# Altium schematic sheet InterceptorRS232.SchDoc
size 594 x 420 mm; Scale: 1:1; Разраб.: Яковлев; Наименование изделия 1: Перехватчик RS-232; Наименование изделия 2: Схема электрическая; Наименование изделия 3: принципиальная; Нач. отд.: Нач. отд.
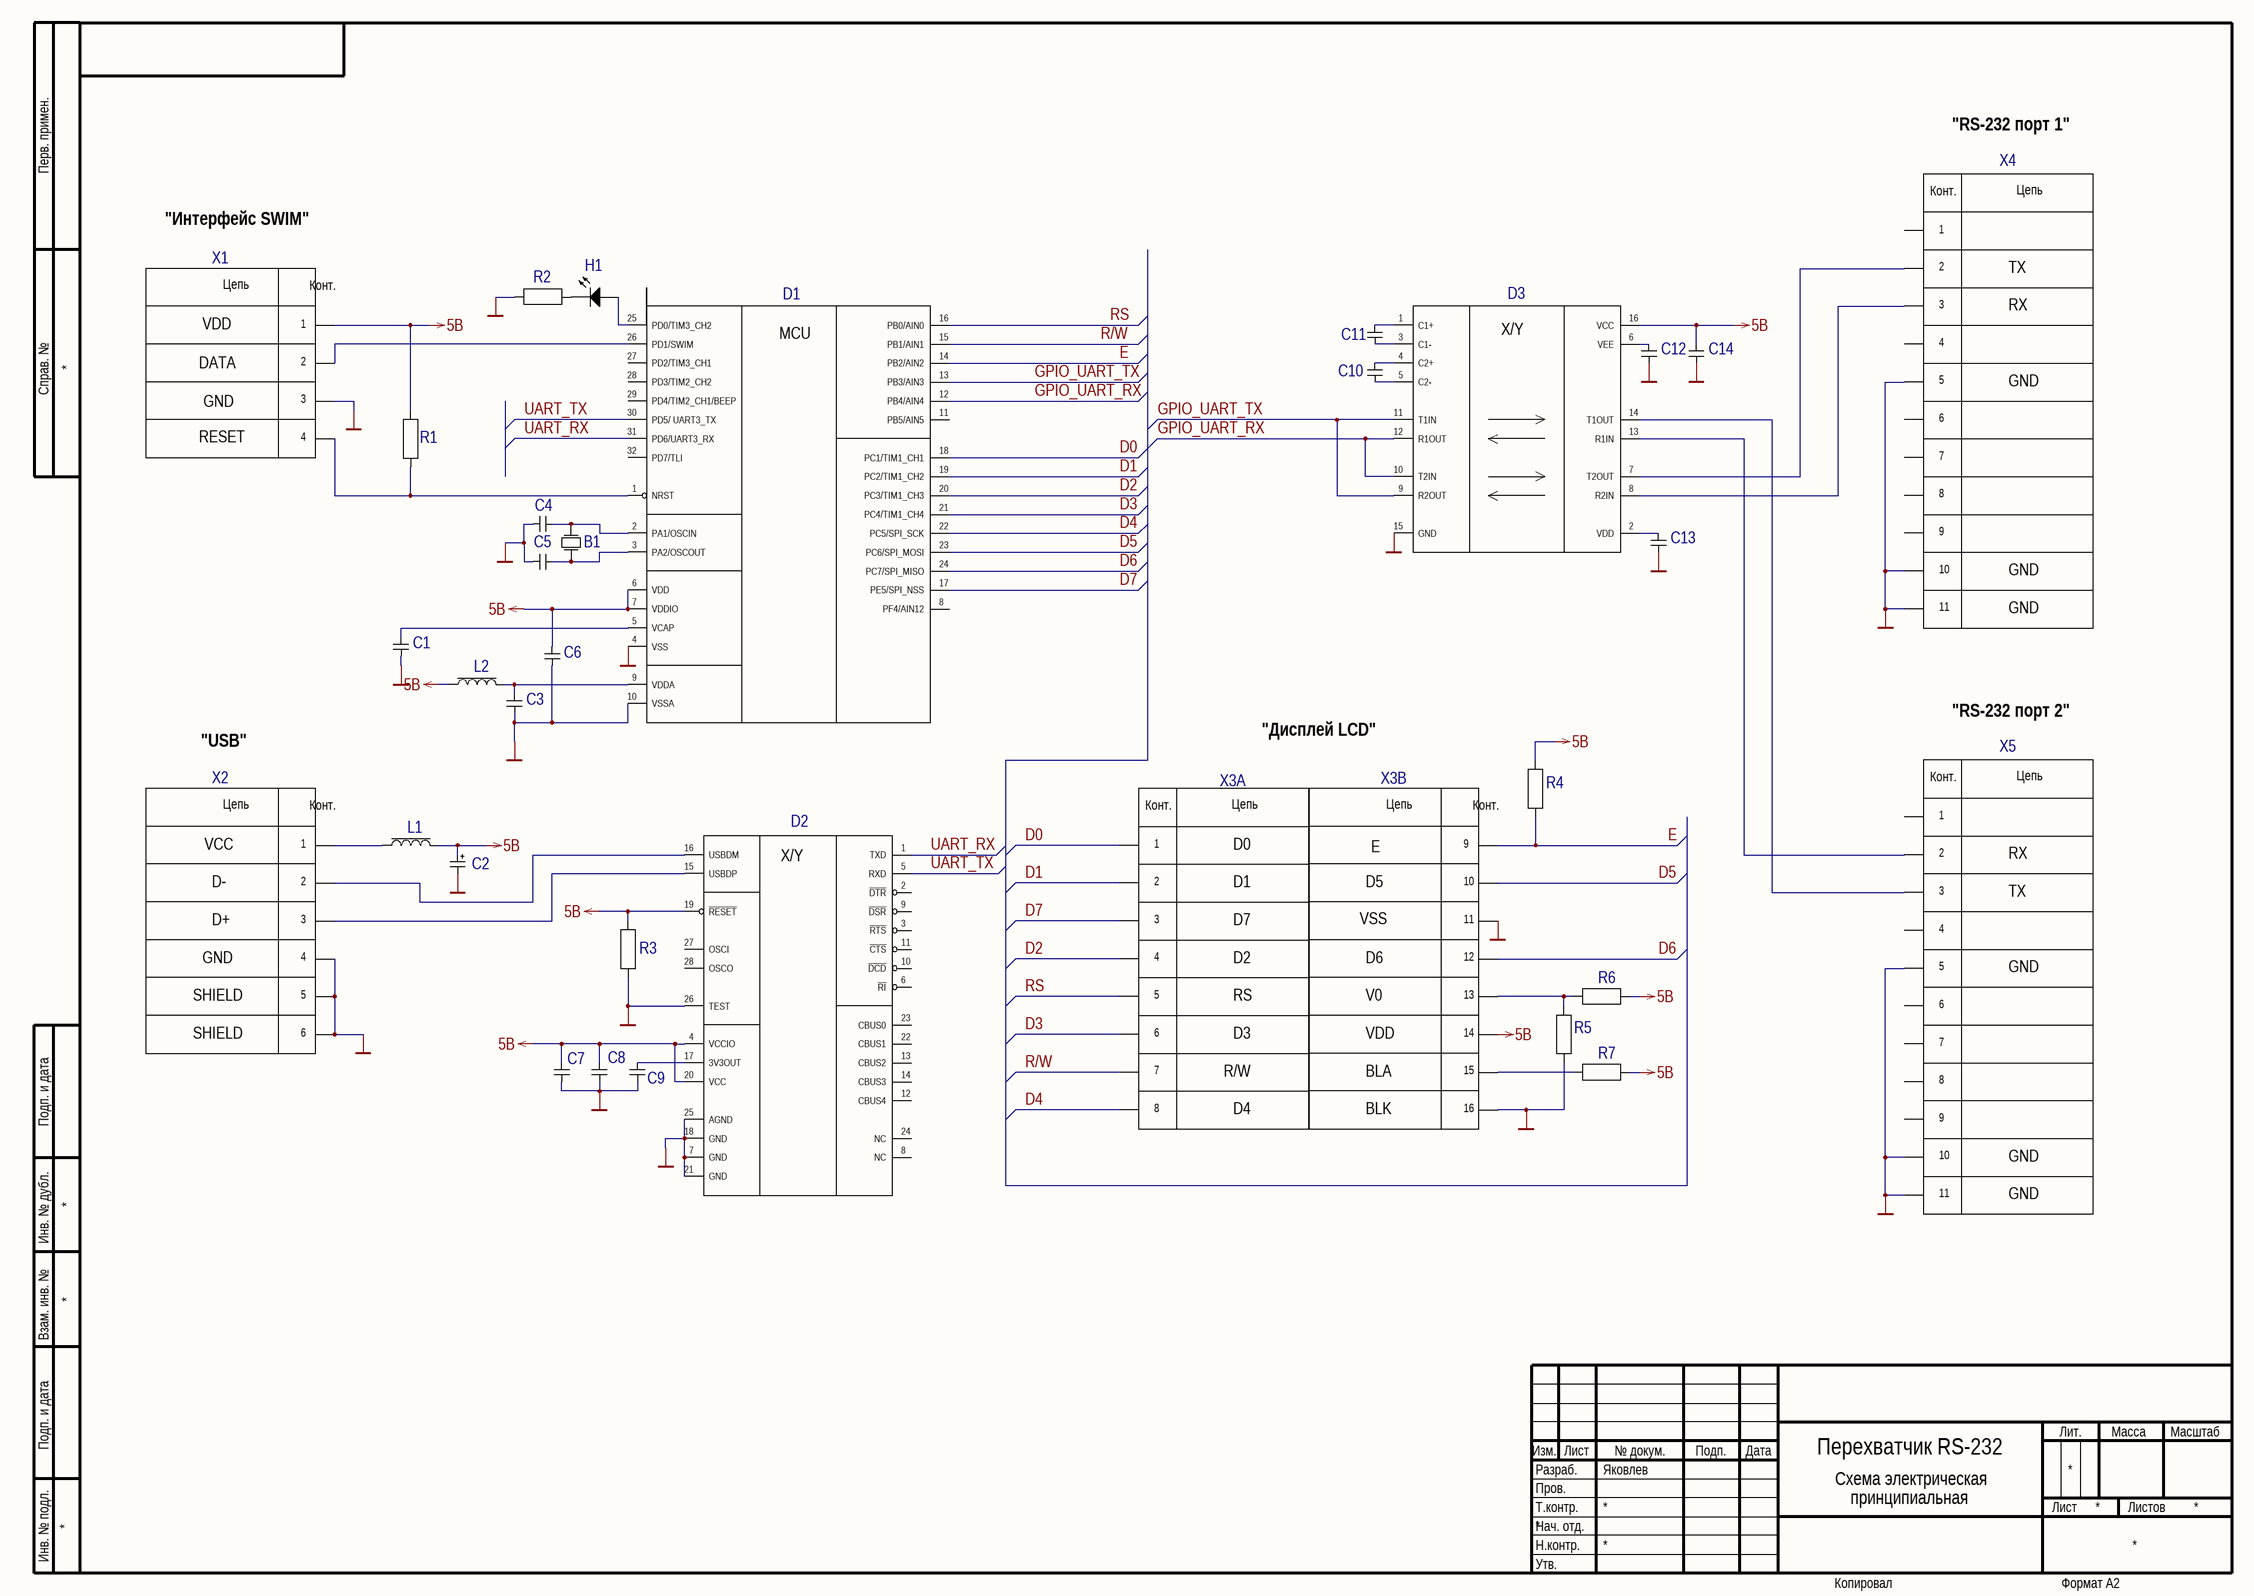
[diagram p0: InterceptorRS232.SchDoc]

## Parts
B1  *  [CSM-7]  (value not drawn)
C1  (no value)  [SMD-0805C]
C2  Cap_el  [CAP_5x11]  (value not drawn)
C3  (no value)  [SMD-0805C]
C4  (no value)  [SMD-0805C]
C5  (no value)  [SMD-0805C]
C6  (no value)  [SMD-0805C]
C7  (no value)  [SMD-0805C]
C8  (no value)  [SMD-0805C]
C9  (no value)  [SMD-0805C]
C10  (no value)  [SMD-0805C]
C11  (no value)  [SMD-0805C]
C12  (no value)  [SMD-0805C]
C13  (no value)  [SMD-0805C]
C14  (no value)  [SMD-0805C]
D1  STM8S207K6T6C  [TQFP32_M]  (value not drawn)
D2  FT232RL-Reel  [SSOP-28_M]  (value not drawn)
D3  MAX232EWE  [SOP-16 (2.54 mm)]  (value not drawn)
H1  (no value)  [LED_3mm]
L1  Inductor  [SMD-0805C]  (value not drawn)
L2  Inductor  [SMD-0805C]  (value not drawn)
R1  (no value)  [SMD-0805-RES]
R2  (no value)  [SMD-0805-RES]
R3  (no value)  [SMD-0805-RES]
R4  (no value)  [SMD-0805-RES]
R5  (no value)  [SMD-0805-RES]
R6  (no value)  [SMD-0805-RES]
R7  (no value)  [SMD-0805-RES]
X1  *  [PLS-4]  (value not drawn)
X2  *  [FCI USB 61729-0010BLF]  (value not drawn)
X3  *  [PLD2x8]  (value not drawn)  (parts A,B of 2)
X4  *  [DB-9F]  (value not drawn)
X5  *  [DB-9M]  (value not drawn)

## Nets
5В: C2.1 C6.2 C7.2 C8.2 C14.2 D1.6(VDD) D1.7(VDDIO) D2.4(VCCIO) D2.19(~{RESET}) D2.20(VCC) D3.16(VCC) L1.2 L2.1 R1.2 R3.2 R4.1 R6.1 R7.1 X1.1 X3.14
GND: C1.1 C2.2 C3.1 C4.2 C5.2 C6.1 C7.1 C8.1 C9.1 C12.1 C13.1 C14.1 D1.4(VSS) D1.10(VSSA) D2.7(GND) D2.18(GND) D2.21(GND) D2.25(AGND) D2.26(TEST) D3.15(GND) R2.2 R3.1 R5.2 X1.3 X2.4 X2.5 X2.6 X3.11 X3.16 X4.5 X4.10 X4.11 X5.5 X5.10 X5.11
D0: D1.18(PC1/TIM1_CH1) X3.1
D1: D1.19(PC2/TIM1_CH2) X3.2
D2: D1.20(PC3/TIM1_CH3) X3.4
D3: D1.21(PC4/TIM1_CH4) X3.6
D4: D1.22(PC5/SPI_SCK) X3.8
D5: D1.23(PC6/SPI_MOSI) X3.10
D6: D1.24(PC7/SPI_MISO) X3.12
D7: D1.17(PE5/SPI_NSS) X3.3
E: D1.14(PB2/AIN2) R4.2 X3.9
GPIO_UART_RX: D1.12(PB4/AIN4) D3.10(T2IN) D3.12(R1OUT)
GPIO_UART_TX: D1.13(PB3/AIN3) D3.9(R2OUT) D3.11(T1IN)
R/W: D1.15(PB1/AIN1) X3.7
RS: D1.16(PB0/AIN0) X3.5
UART_RX: D1.31(PD6/UART3_RX) D2.1(TXD)
UART_TX: D1.30(PD5/_UART3_TX) D2.5(RXD)
NetB1_1: B1.1(OSCIN) C5.1 D1.3(PA2/OSCOUT)
NetB1_2: B1.2(OSCOUT) C4.1 D1.2(PA1/OSCIN)
NetC1_2: C1.2 D1.5(VCAP)
NetC3_2: C3.2 D1.9(VDDA) L2.2
NetC9_2: C9.2 D2.17(3V3OUT)
NetC10_1: C10.1 D3.5(C2-)
NetC10_2: C10.2 D3.4(C2+)
NetC11_1: C11.1 D3.3(C1-)
NetC11_2: C11.2 D3.1(C1+)
NetC12_2: C12.2 D3.6(VEE)
NetC13_2: C13.2 D3.2(VDD)
NetD1_1: D1.1(NRST) R1.1 X1.4
NetD1_25: D1.25(PD0/TIM3_CH2) H1.1(A)
NetD1_26: D1.26(PD1/SWIM) X1.2
NetD2_15: D2.15(USBDP) X2.3
NetD2_16: D2.16(USBDM) X2.2
NetD3_7: D3.7(T2OUT) X4.2
NetD3_8: D3.8(R2IN) X4.3
NetD3_13: D3.13(R1IN) X5.2
NetD3_14: D3.14(T1OUT) X5.3
NetH1_2: H1.2(K) R2.1
NetL1_1: L1.1 X2.1
NetR5_1: R5.1 R6.2 X3.13
NetR7_2: R7.2 X3.15

Not connected (* = marked no-connect by the designer): D1 8(PF4/AIN12) 11(PB5/AIN5) 27(PD2/TIM3_CH1) 28(PD3/TIM2_CH2) 29(PD4/TIM2_CH1/BEEP) 32(PD7/TLI); D2 2(~{DTR}) 3(~{RTS}) 6(~{RI}) 8(NC) 9(~{DSR}) 10(~{DCD}) 11(~{CTS}) 12(CBUS4) 13(CBUS2) 14(CBUS3) 22(CBUS1) 23(CBUS0) 24(NC) 27(OSCI) 28(OSCO); X4 1 4 6 7 8 9; X5 1 4 6 7 8 9

## Notes on the sheet
- "RS-232 порт 1"
- "Интерфейс SWIM"
- RX
- TX
- VDD
- DATA
- GND
- RESET
- "Дисплей LCD"
- "RS-232 порт 2"
- "USB"
- VCC
- D-
- D1
- D0
- D5
- E
- D+
- D7
- VSS
- D2
- D6
- SHIELD
- RS
- V0
- R/W
- D3
- BLA
- D4
- BLK
- Перв. примен.
- Справ. №
- Подп. и дата
- Инв. № дубл.
- Взам. инв. №
- Разраб.
- Изм.
- Лист
- № докум.
- Подп.
- Дата
- Лит.
- Масса
- Масштаб
- Пров.
- Т.контр.
- Листов
- Инв. № подл.
- Утв.
- Н.контр.
- Копировал
- Формат А2
- (in symbol DB-9) Конт.; Цепь
- (in symbol FT232RL-Reel) X/Y
- (in symbol MAX232EWE) X/Y
- (in symbol PLD2x8, part A) Конт.; Цепь
- (in symbol PLD2x8, part B) Цепь; Конт.
- (in symbol PLS-4) Цепь; Конт.
- (in symbol STM8S207/STM8S208) MCU
- (in symbol USB-B) Цепь; Конт.

## Library data of the parts
B1 = CRYSTAL_OSCILLATOR: Crystal oscillator
C1 C3-C14 = Cap: Capacitor; Published: 8-Jun-2000; LatestRevisionDate: 17-Jul-2002; LatestRevisionNote: Re-released for DXP Platform.; PackageReference: RAD-0.3; Publisher: Altium Limited; PackageDescription: Radial Cap, Thru-Hole; 2 Leads; 0.3 in Pin Spacing
C2 = Cap_el: Electrolytic capacitor; Published: 8-Jun-2000; LatestRevisionDate: 17-Jul-2002; LatestRevisionNote: Re-released for DXP Platform.; PackageReference: RAD-0.3; Publisher: Altium Limited; PackageDescription: Radial Cap, Thru-Hole; 2 Leads; 0.3 in Pin Spacing
D1 = STM8S207/STM8S208: 8-bit STM8 MCU
D2 = FT232RL-Reel: USB UART Asynchronous Serial Data Transfer Chip, SSOP-28, Tape and Reel; Published: 19-Aug-2010; DatasheetVersion: ver 2.07, Jul-2010; PackageVersion: 2010; PackageReference: SSOP-28; Publisher: Altium Limited; PackageDescription: 28-Pin Small Outline Package 0.65 mm Pitch; ComponentLink1Description: Manufacturer Link; ComponentLink1URL: http://www.ftdichip.com/Products/ICs/FT232R.htm; ComponentLink2Description: Datasheet; ComponentLink2URL: http://www.ftdichip.com/Support/Documents/DataSheets/ICs/DS_FT232R.pdf
D3 = MAX232EWE: +5V Powered RS-232 Driver/Receiver; Published: 16-Jan-2001; LatestRevisionDate: 13-Apr-2006; LatestRevisionNote: IPC-7351 Footprint Added.; DatasheetVersion: Apr-1992; PackageReference: WSO16; Publisher: Altium Limited; PackageDescription: 16-Pin Small Outline Integrated Circuit 1.27 mm Pitch; Code_JEDEC: MS-013-AA; Code_IPC: SOIC127P1030-16; ComponentLink1Description: Manufacturer Link; ComponentLink1URL: http://www.maxim-ic.com/; ComponentLink2Description: Datasheet; ComponentLink2URL: http://pdfserv.maxim-ic.com/en/ds/MAX220-MAX249.pdf
H1 = LED0: Typical INFRARED GaAs LED; Published: 8-Jun-2000; LatestRevisionDate: 08-Jul-2005; LatestRevisionNote: Mech Layer 1 removed.; PackageReference: LED-0; Publisher: Altium Limited; PackageDescription: LED; 2 Leads
L1 L2 = Inductor: Code_IEC: 1005; Value: 10mH; Published: 8-Jun-2000; LatestRevisionDate: 29-May-2009; LatestRevisionNote: IPC-7351 Footprint Added.; PackageReference: 0402-A; Publisher: Altium Limited; PackageDescription: Chip Inductor; Code_JEITA: 0402
R1-R7 = Res2: Resistor; Value: 1K; Published: 8-Jun-2000; LatestRevisionDate: 17-Jul-2002; LatestRevisionNote: Re-released for DXP Platform.; PackageReference: AXIAL-0.4; Publisher: Altium Limited; PackageDescription: Axial Device, Thru-Hole; 2 Leads; 0.4 in Pin Spacing
X1 = PLS-4: PLS-4 connector
X2 = USB-B: USB-B connector
X3 = PLD2x8: PLD2x8 connector
X4 X5 = DB-9: DB-9 connector